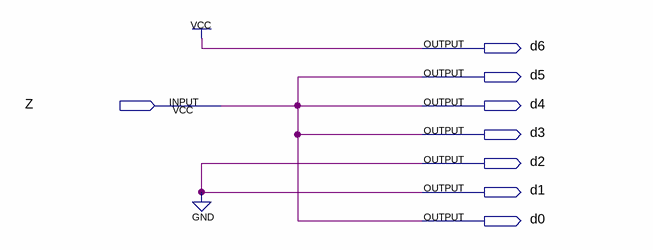
[diagram p0: schematic sheet]
// Quartus schematic b.bdf as structural Verilog: 0 symbols, 8 pins
module b (
  input  Z,
  output d6,
  output d5,
  output d4,
  output d3,
  output d2,
  output d1,
  output d0
);


  assign d0 = Z;
  assign d1 = 1'b0;
  assign d2 = 1'b0;
  assign d3 = Z;
  assign d4 = Z;
  assign d5 = Z;
  assign d6 = 1'b1;
endmodule
